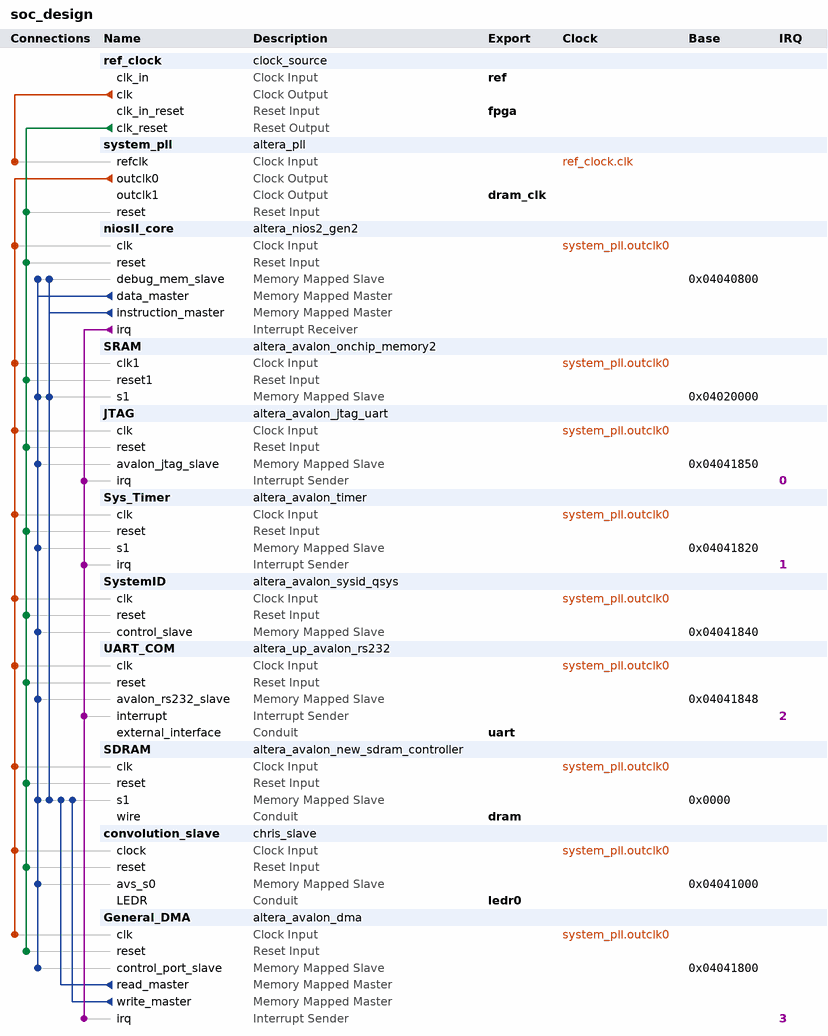
[diagram p0: system contents]
# Platform Designer (Qsys) system soc_design, Cyclone V 5CEBA4F23C7
# Parameters at their usual value, and those the tool derives, are not listed.
package require -exact qsys 16.0
create_system soc_design
set_project_property DEVICE_FAMILY {Cyclone V}
set_project_property DEVICE 5CEBA4F23C7

add_instance ref_clock clock_source 16.0
set_instance_parameter_value ref_clock clockFrequency 50000000

add_instance system_pll altera_pll 16.0
set_instance_parameter_value system_pll gui_device_speed_grade 1
set_instance_parameter_value system_pll gui_number_of_clocks 2
set_instance_parameter_value system_pll gui_operation_mode direct
set_instance_parameter_value system_pll gui_output_clock_frequency0 100.0
set_instance_parameter_value system_pll gui_output_clock_frequency1 100.0
set_instance_parameter_value system_pll gui_phase_shift_deg1 -63.0
set_instance_parameter_value system_pll gui_pll_mode {Integer-N PLL}
set_instance_parameter_value system_pll gui_ps_units1 degrees
set_instance_parameter_value system_pll gui_reference_clock_frequency 50.0
set_instance_parameter_value system_pll gui_use_locked false

add_instance niosII_core altera_nios2_gen2 16.0
set_instance_parameter_value niosII_core dcache_bursts true
set_instance_parameter_value niosII_core dcache_size 2048
set_instance_parameter_value niosII_core exceptionSlave Absolute
set_instance_parameter_value niosII_core icache_burstType Sequential
set_instance_parameter_value niosII_core icache_size 4096
set_instance_parameter_value niosII_core impl Fast
set_instance_parameter_value niosII_core resetSlave Absolute

add_instance SRAM altera_avalon_onchip_memory2 16.0
set_instance_parameter_value SRAM dataWidth 32
set_instance_parameter_value SRAM dualPort false
set_instance_parameter_value SRAM initMemContent true
set_instance_parameter_value SRAM initializationFileName onchip_mem.hex
set_instance_parameter_value SRAM memorySize 81920

add_instance JTAG altera_avalon_jtag_uart 16.0
set_instance_parameter_value JTAG simInteractiveOptions NO_INTERACTIVE_WINDOWS

add_instance Sys_Timer altera_avalon_timer 16.0
set_instance_parameter_value Sys_Timer alwaysRun true
set_instance_parameter_value Sys_Timer fixedPeriod true
set_instance_parameter_value Sys_Timer period 1
set_instance_parameter_value Sys_Timer periodUnits MSEC
set_instance_parameter_value Sys_Timer snapshot false

add_instance SystemID altera_avalon_sysid_qsys 16.0
set_instance_parameter_value SystemID id 255

add_instance UART_COM altera_up_avalon_rs232 15.1
set_instance_parameter_value UART_COM baud 115200
set_instance_parameter_value UART_COM parity None

add_instance SDRAM altera_avalon_new_sdram_controller 16.0
set_instance_parameter_value SDRAM TAC 5.4
set_instance_parameter_value SDRAM TMRD 2
set_instance_parameter_value SDRAM TRCD 30.0
set_instance_parameter_value SDRAM TRFC 80.0
set_instance_parameter_value SDRAM TRP 30.0
set_instance_parameter_value SDRAM TWR 20.0
set_instance_parameter_value SDRAM casLatency 3
set_instance_parameter_value SDRAM columnWidth 10
set_instance_parameter_value SDRAM dataWidth 16
set_instance_parameter_value SDRAM generateSimulationModel false
set_instance_parameter_value SDRAM initRefreshCommands 8
set_instance_parameter_value SDRAM model single_Micron_MT48LC4M32B2_7_chip
set_instance_parameter_value SDRAM numberOfBanks 4
set_instance_parameter_value SDRAM numberOfChipSelects 1
set_instance_parameter_value SDRAM powerUpDelay 200.0
set_instance_parameter_value SDRAM refreshPeriod 31.25
set_instance_parameter_value SDRAM rowWidth 13

add_instance convolution_slave chris_slave 1.0

add_instance General_DMA altera_avalon_dma 16.0
set_instance_parameter_value General_DMA allowByteTransactions true
set_instance_parameter_value General_DMA allowDoubleWordTransactions true
set_instance_parameter_value General_DMA allowHalfWordTransactions true
set_instance_parameter_value General_DMA allowQuadWordTransactions true
set_instance_parameter_value General_DMA burstEnable false
set_instance_parameter_value General_DMA fifoDepth 512
set_instance_parameter_value General_DMA maxBurstSize 128
set_instance_parameter_value General_DMA minimumDmaTransactionRegisterWidth 13

# connections
add_connection ref_clock.clk system_pll.refclk clock
add_connection system_pll.outclk0 convolution_slave.clock clock
add_connection system_pll.outclk0 General_DMA.clk clock
add_connection system_pll.outclk0 JTAG.clk clock
add_connection system_pll.outclk0 niosII_core.clk clock
add_connection system_pll.outclk0 SDRAM.clk clock
add_connection system_pll.outclk0 SRAM.clk1 clock
add_connection system_pll.outclk0 Sys_Timer.clk clock
add_connection system_pll.outclk0 SystemID.clk clock
add_connection system_pll.outclk0 UART_COM.clk clock
add_connection ref_clock.clk_reset convolution_slave.reset reset
add_connection ref_clock.clk_reset General_DMA.reset reset
add_connection ref_clock.clk_reset JTAG.reset reset
add_connection ref_clock.clk_reset niosII_core.reset reset
add_connection ref_clock.clk_reset SDRAM.reset reset
add_connection ref_clock.clk_reset SRAM.reset1 reset
add_connection ref_clock.clk_reset Sys_Timer.reset reset
add_connection ref_clock.clk_reset system_pll.reset reset
add_connection ref_clock.clk_reset SystemID.reset reset
add_connection ref_clock.clk_reset UART_COM.reset reset
add_connection General_DMA.read_master SDRAM.s1 avalon
set_connection_parameter_value General_DMA.read_master/SDRAM.s1 baseAddress 0x0000
add_connection General_DMA.write_master SDRAM.s1 avalon
set_connection_parameter_value General_DMA.write_master/SDRAM.s1 baseAddress 0x0000
add_connection niosII_core.data_master convolution_slave.avs_s0 avalon
set_connection_parameter_value niosII_core.data_master/convolution_slave.avs_s0 baseAddress 0x04041000
add_connection niosII_core.data_master General_DMA.control_port_slave avalon
set_connection_parameter_value niosII_core.data_master/General_DMA.control_port_slave baseAddress 0x04041800
add_connection niosII_core.data_master JTAG.avalon_jtag_slave avalon
set_connection_parameter_value niosII_core.data_master/JTAG.avalon_jtag_slave baseAddress 0x04041850
add_connection niosII_core.data_master niosII_core.debug_mem_slave avalon
set_connection_parameter_value niosII_core.data_master/niosII_core.debug_mem_slave baseAddress 0x04040800
add_connection niosII_core.data_master SDRAM.s1 avalon
set_connection_parameter_value niosII_core.data_master/SDRAM.s1 baseAddress 0x0000
add_connection niosII_core.data_master SRAM.s1 avalon
set_connection_parameter_value niosII_core.data_master/SRAM.s1 baseAddress 0x04020000
add_connection niosII_core.data_master Sys_Timer.s1 avalon
set_connection_parameter_value niosII_core.data_master/Sys_Timer.s1 baseAddress 0x04041820
add_connection niosII_core.data_master SystemID.control_slave avalon
set_connection_parameter_value niosII_core.data_master/SystemID.control_slave baseAddress 0x04041840
add_connection niosII_core.data_master UART_COM.avalon_rs232_slave avalon
set_connection_parameter_value niosII_core.data_master/UART_COM.avalon_rs232_slave baseAddress 0x04041848
add_connection niosII_core.instruction_master niosII_core.debug_mem_slave avalon
set_connection_parameter_value niosII_core.instruction_master/niosII_core.debug_mem_slave baseAddress 0x04040800
add_connection niosII_core.instruction_master SDRAM.s1 avalon
set_connection_parameter_value niosII_core.instruction_master/SDRAM.s1 baseAddress 0x0000
add_connection niosII_core.instruction_master SRAM.s1 avalon
set_connection_parameter_value niosII_core.instruction_master/SRAM.s1 baseAddress 0x04020000
add_connection niosII_core.irq General_DMA.irq interrupt
set_connection_parameter_value niosII_core.irq/General_DMA.irq irqNumber 3
add_connection niosII_core.irq JTAG.irq interrupt
set_connection_parameter_value niosII_core.irq/JTAG.irq irqNumber 0
add_connection niosII_core.irq Sys_Timer.irq interrupt
set_connection_parameter_value niosII_core.irq/Sys_Timer.irq irqNumber 1
add_connection niosII_core.irq UART_COM.interrupt interrupt
set_connection_parameter_value niosII_core.irq/UART_COM.interrupt irqNumber 2

# exported interfaces
add_interface dram conduit end
set_interface_property dram EXPORT_OF SDRAM.wire
add_interface dram_clk clock source
set_interface_property dram_clk EXPORT_OF system_pll.outclk1
add_interface fpga reset sink
set_interface_property fpga EXPORT_OF ref_clock.clk_in_reset
add_interface ledr0 conduit end
set_interface_property ledr0 EXPORT_OF convolution_slave.LEDR
add_interface ref clock sink
set_interface_property ref EXPORT_OF ref_clock.clk_in
add_interface uart conduit end
set_interface_property uart EXPORT_OF UART_COM.external_interface

set_interconnect_requirement {$system} qsys_mm.clockCrossingAdapter HANDSHAKE
set_interconnect_requirement {$system} qsys_mm.enableEccProtection FALSE
set_interconnect_requirement {$system} qsys_mm.insertDefaultSlave FALSE
set_interconnect_requirement {$system} qsys_mm.maxAdditionalLatency 1

save_system soc_design.qsys
